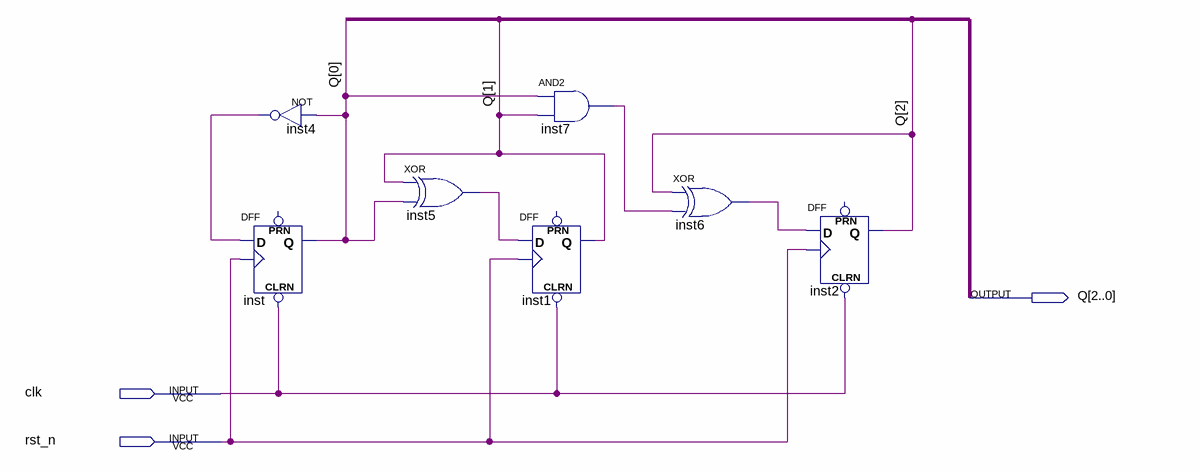
[diagram p0: schematic sheet]
// Quartus schematic Contador.bdf as structural Verilog: 7 symbols, 3 pins
module Contador (
  input  clk,
  input  rst_n,
  output [2:0] Q
);

  wire inst4_out, inst5_out, inst6_out, inst7_out;

  not inst4 (inst4_out, Q[0]);
  DFF inst (.CLRN(clk), .CLK(rst_n), .D(inst4_out), .Q(Q[0]));  // open: PRN
  xor inst5 (inst5_out, Q[1], Q[0]);
  and inst7 (inst7_out, Q[0], Q[1]);
  DFF inst1 (.CLRN(clk), .CLK(rst_n), .D(inst5_out), .Q(Q[1]));  // open: PRN
  xor inst6 (inst6_out, Q[2], inst7_out);
  DFF inst2 (.CLRN(clk), .CLK(rst_n), .D(inst6_out), .Q(Q[2]));  // open: PRN
endmodule
